# EAGLE design RFM12B Breakout (EAGLE 6.2)
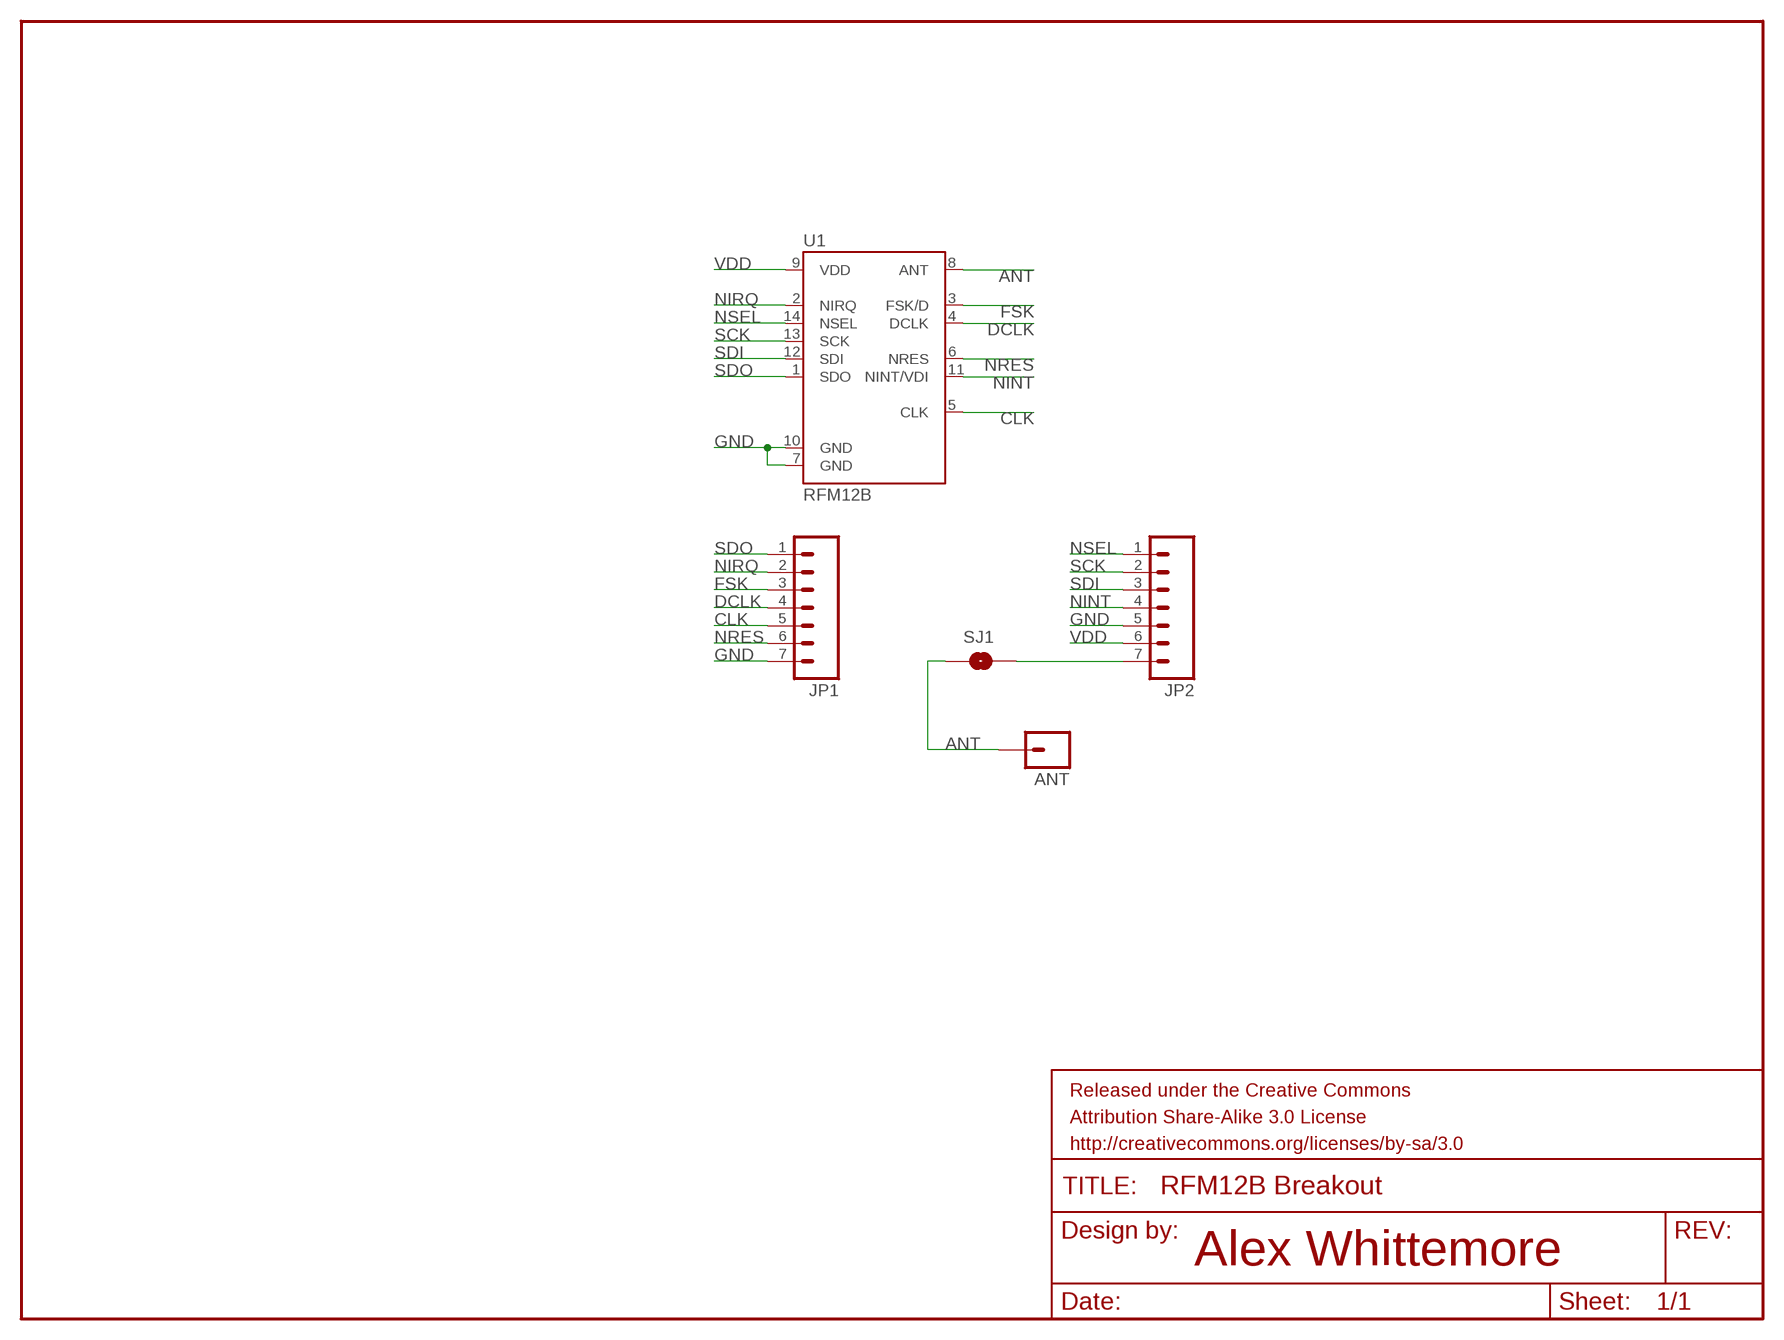
[diagram p0: schematic, sheet 1]

## Parts
ANT  M01PTH  [1X01]
JP1  M07LOCK  [1X07_LOCK]
JP2  M07LOCK  [1X07_LOCK]
SJ1  SOLDERJUMPERNO  [SJ_2S-NO]
U1  RFM12B  [RFM12-XXX-S2]

## Nets
ANT: ANT.1 SJ1.1 U1.8(ANT)
CLK: JP1.5 U1.5(CLK)
DCLK: JP1.4 U1.4(DCLK)
FSK: JP1.3 U1.3(FSK/D)
GND: JP1.7 JP2.5 U1.7(GND) U1.10(GND)
N$1: JP2.7 SJ1.2
NINT: JP2.4 U1.11(NINT/VDI)
NIRQ: JP1.2 U1.2(NIRQ)
NRES: JP1.6 U1.6(NRES)
NSEL: JP2.1 U1.14(NSEL)
SCK: JP2.2 U1.13(SCK)
SDI: JP2.3 U1.12(SDI)
SDO: JP1.1 U1.1(SDO)
VDD: JP2.6 U1.9(VDD)

## Notes on the sheet
- Alex Whittemore

## Library data of the parts
ANT = SparkFun-Connectors:M01: Header 1 Standard 1-pin 0.1" header. Use with straight break away headers (SKU : PRT-00116), right angle break away headers (PRT-00553), swiss pins (PRT-00743), machine pins (PRT-00117), and female headers (PRT-00115).
JP1 JP2 = SparkFun-Connectors:M07: Header 7 Standard 7-pin 0.1" header. Use with straight break away headers (SKU : PRT-00116), right angle break away headers (PRT-00553), swiss pins (PRT-00743), machine pins (PRT-00117), and female headers (PRT-00115). NOTES ON THE VARIANTS LOCK and LOCK_LONGPADS... This footprint was designed to help hold the alignment of a through-hole component (i.e. 7-pin header) while soldering it into place. You may notice that each hole has been shifted either up or down by 0.005 of an inch from it's more standard position (which is usually a perfectly straight line). This slight alteration caused the pins (the squares in the middle) to touch the edges of the holes. Because they are alternating, it causes a "brace" to hold the header in place. 0.005 has proven to be the perfect amount of "off-center" position when using our standard breakaway headers. Although looks a little odd when you look at the bare footprint, once you have a header in there, the alteration is very hard to notice. Also, if you push a header all the way into place, it is covered up entirely on the bottom side. This idea of altering the position of holes to aid alignment will be further integrated into the Sparkfun Library for other footprints. It can help hold any component with 3 or more connection pins.
SJ1 = BUBB-Eagle-Library:SOLDERJUMPER: Solder Jumper Standard SMD solder jumper. Used to automate production. Two varients : Normally Open and Normally Closed are the same, but have different paste layers. NC will have a large amount of paste and should jumper during reflow.
U1 = AlexW-Eagle-Libraries:RFM12B

## Board
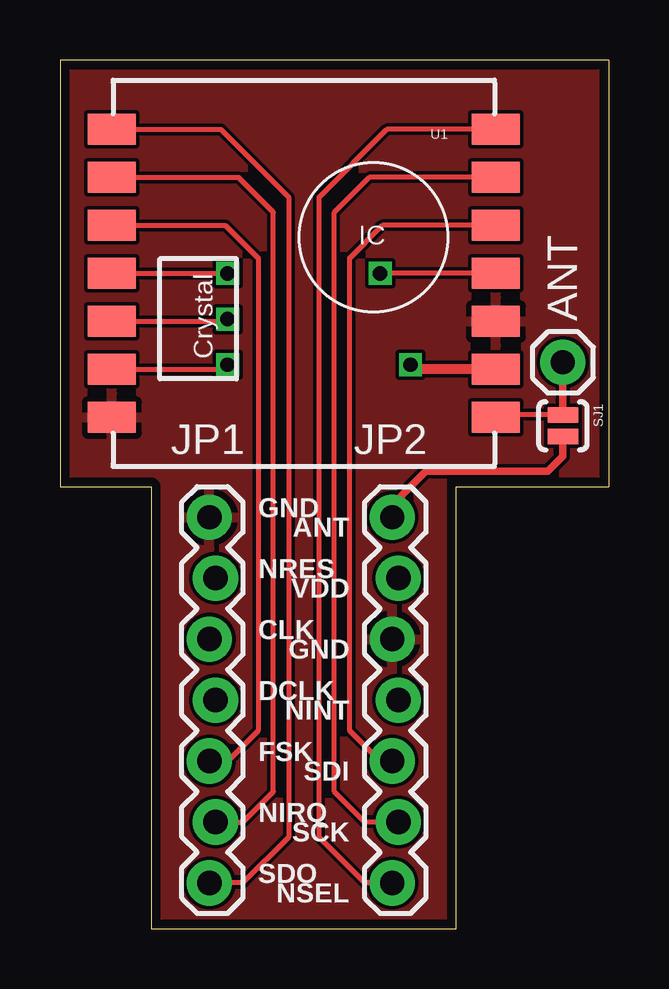
[diagram p1: board, top side]
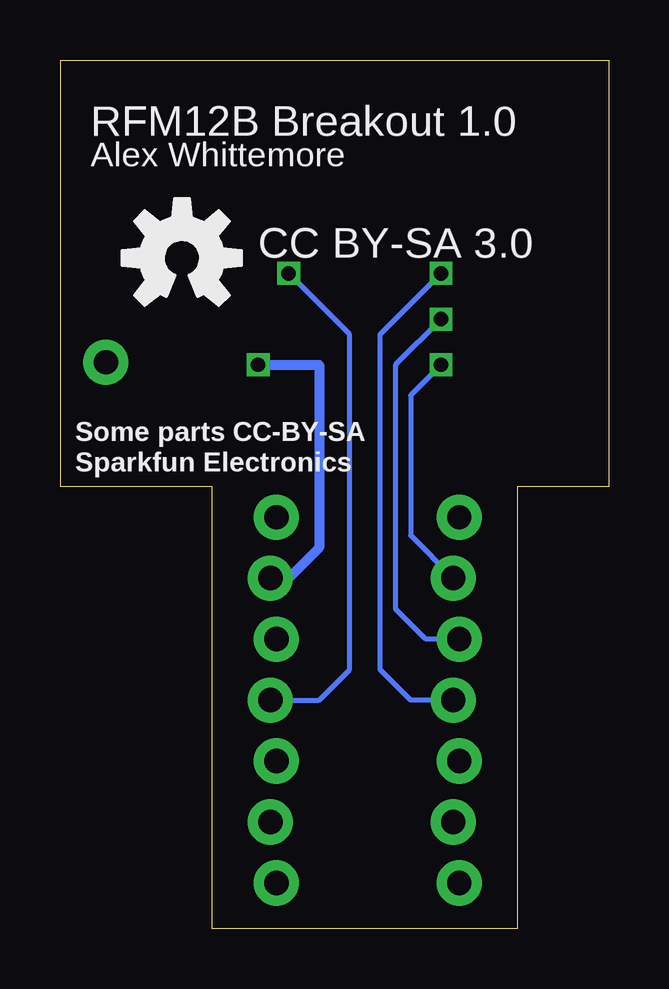
[diagram p2: board, bottom side, seen from below]

Size 22.86 x 36.2 mm. Coordinates in mm from the lower left corner, seen from the top.
Outline: 22.86,36.2 0,36.2 0,18.41 3.81,18.41 3.81,0 16.51,0 16.51,18.41 22.86,18.41 22.86,36.2
Copper layers (1*16): Top 0.0356mm / dielectric 1.5011mm / Bottom 0.0356mm
Design rules: minimum track width 6mil, minimum drill 13mil, track to track 6mil, track to pad 6mil, pad to pad 6mil, via to via 6mil, smd to smd 6mil, copper to edge 15mil, drill to drill 6mil, minimum pad ring 7mil, minimum via ring 7mil, stop-mask expansion 4mil, vias tented up to drill 0mil, thermal gap 10mil

### Footprints (pad centres in the part's own frame; a part is rotated, then mirrored left to right if it is on the bottom)
1X01 = drill 1.016 pad 1.88: 1 0,0
1X07_LOCK = drill 1.016 pad 1.88: 1 0,0.127; 2 2.54,-0.127; 3 5.08,0.127; 4 7.62,-0.127; 5 10.16,0.127; 6 12.7,-0.127; 7 15.24,0.127
SJ_2S-NO = smd 0.635 x 1.27: 1 -0.45,0; 2 0.45,0
RFM12-XXX-S2 = smd 2 x 1.3: 1 -8,6; 2 -8,4; 3 -8,2; 4 -8,0; 5 -8,-2; 6 -8,-4; 7 -8,-6; 8 8,-6; 9 8,-4; 10 8,-2; 11 8,0; 12 8,2; 13 8,4; 14 8,6

### Placement (x,y rotation side)
ANT  20.95,23.6 0 top
JP1  6.35,1.91 90 top
JP2  13.97,1.91 90 top
SJ1  20.95,20.95 270 top
U1  10.16,27.3 0 top
U$1  [OSHW-LOGO-M]  17.78,27.94 0 bottom

### Tracks (layer width: path | path; a pad name or v marks a point on that pad's centre or on a via)
ANT
  Top 0.203: SJ1.1 18.16,21.41 U1.8
  Top 0.305: SJ1.1 ANT.1
CLK  (via drill 0.6)
  Top 0.203: U1.5 6.99,25.3 v6.99,25.4
  Bottom 0.203: v6.99,25.4 8.89,23.5 8.89,13.34 7.62,12.06 JP1.5
DCLK  (via drill 0.6)
  Top 0.203: U1.4 v6.99,27.3
  Bottom 0.203: JP1.4 8.26,9.53 9.53,10.79 9.53,24.77 v6.99,27.3
FSK
  Top 0.203: JP1.3 6.99,6.99 8.26,8.26 8.26,27.94 6.89,29.3 U1.3
GND
  pour Top: 0,36.2 22.86,36.2 22.86,18.41 16.51,18.41 16.51,0 3.81,0 3.81,18.41 0,18.41
N$1
  Top 0.305: SJ1.2 20.95,19.68 20.32,19.05 15.24,19.05 13.34,17.14 JP2.7
NINT  (via drill 0.6)
  Top 0.203: U1.11 v13.34,27.3
  Bottom 0.203: JP2.4 12.06,9.53 10.79,10.79 10.79,24.77 v13.34,27.3
NIRQ
  Top 0.203: JP1.2 7.62,4.45 8.89,5.71 8.89,29.84 7.43,31.3 U1.2
NRES  (via drill 0.6)
  Top 0.203: U1.6 6.99,23.3 v6.99,23.5
  Bottom 0.203: v6.99,23.5 8.26,22.23 8.26,16.38 JP1.6
NSEL
  Top 0.203: JP2.1 12.7,1.91 10.79,3.81 10.79,30.48 13.62,33.3 U1.14
SCK
  Top 0.203: JP2.2 12.7,4.45 11.43,5.71 11.43,29.84 12.89,31.3 U1.13
SDI
  Top 0.203: JP2.3 13.34,6.99 12.06,8.26 12.06,27.94 13.43,29.3 U1.12
SDO
  Top 0.203: JP1.1 7.62,1.91 9.53,3.81 9.53,30.48 6.7,33.3 U1.1
VDD  (via drill 0.6)
  Top 0.406: U1.9 14.61,23.3 v14.61,23.5
  Bottom 0.406: v14.61,23.5 12.06,23.5 12.06,15.88 13.34,14.61 JP2.6

### Text on the board
tPlace: GND | ANT | NRES | VDD | CLK | GND | DCLK | NINT | FSK | SDI | NIRQ | SCK | SDO | NSEL
bPlace: RFM12B Breakout 1.0 | Alex Whittemore | CC BY-SA 3.0 | Some parts CC-BY-SA | Sparkfun Electronics